# Altium schematic sheet Interface.SchDoc
size A
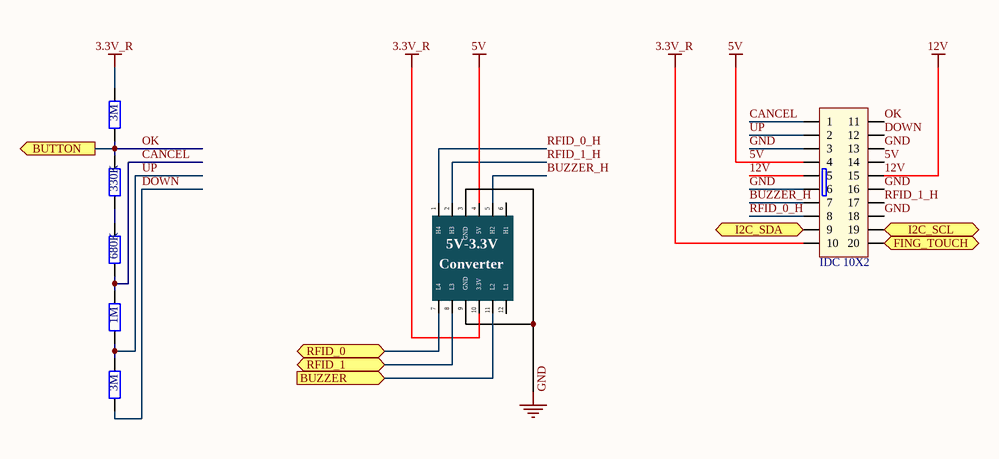
[diagram p0: Interface.SchDoc]

## Parts
Converter_1  Bidirection converter  [5V_3V3_Converter]  (value not drawn)
Interface_Connector  IDC 10X2  [IDC20]
R13  3M  [AXIAL-0.4]
R14  330K  [AXIAL-0.4]
R15  680K  [AXIAL-0.4]
R16  1M  [AXIAL-0.4]
R17  3M  [AXIAL-0.4]

## Ports
BUTTON (out), BUZZER (in), FING_TOUCH (bidir), I2C_SCL (bidir), I2C_SDA (bidir), RFID_0 (bidir), RFID_1 (bidir)

## Nets
3.3V_R: Converter_1.10(3.3V) Interface_Connector.10 R13.1
5V: Converter_1.4(5V) Interface_Connector.4 Interface_Connector.14
12V: Interface_Connector.5 Interface_Connector.15
GND: Converter_1.3(GND) Converter_1.9(GND) Interface_Connector.3 Interface_Connector.6 Interface_Connector.13 Interface_Connector.16 Interface_Connector.18
BUZZER: Converter_1.11(L2) ; port BUZZER
BUZZER_H: Converter_1.5(H2) Interface_Connector.7
CANCEL: Interface_Connector.1 R15.2 R16.1
DOWN: Interface_Connector.12 R17.2
FING_TOUCH: Interface_Connector.20 ; port FING_TOUCH
I2C_SCL: Interface_Connector.19 ; port I2C_SCL
I2C_SDA: Interface_Connector.9 ; port I2C_SDA
OK: Interface_Connector.11 R13.2 R14.1 ; port BUTTON
RFID_0: Converter_1.7(L4) ; port RFID_0
RFID_0_H: Converter_1.1(H4) Interface_Connector.8
RFID_1: Converter_1.8(L3) ; port RFID_1
RFID_1_H: Converter_1.2(H3) Interface_Connector.17
UP: Interface_Connector.2 R16.2 R17.1
NetR14_2: R14.2 R15.1

Not connected (* = marked no-connect by the designer): Converter_1 6(H1) 12(L1)

## Notes on the sheet
- (in symbol 5V-3.3V-converter) 5V-3.3V; Converter

## Library data of the parts
Converter_1 = 5V-3.3V-converter
Interface_Connector = IDC 10X2: Value: Header 5x2
R13-R17 = Res2: Resistor; Published: 8-Jun-2000; LatestRevisionDate: 17-Jul-2002; LatestRevisionNote: Re-released for DXP Platform.; PackageReference: AXIAL-0.4; Publisher: Altium Limited; PackageDescription: Axial Device, Thru-Hole; 2 Leads; 0.4 in Pin Spacing